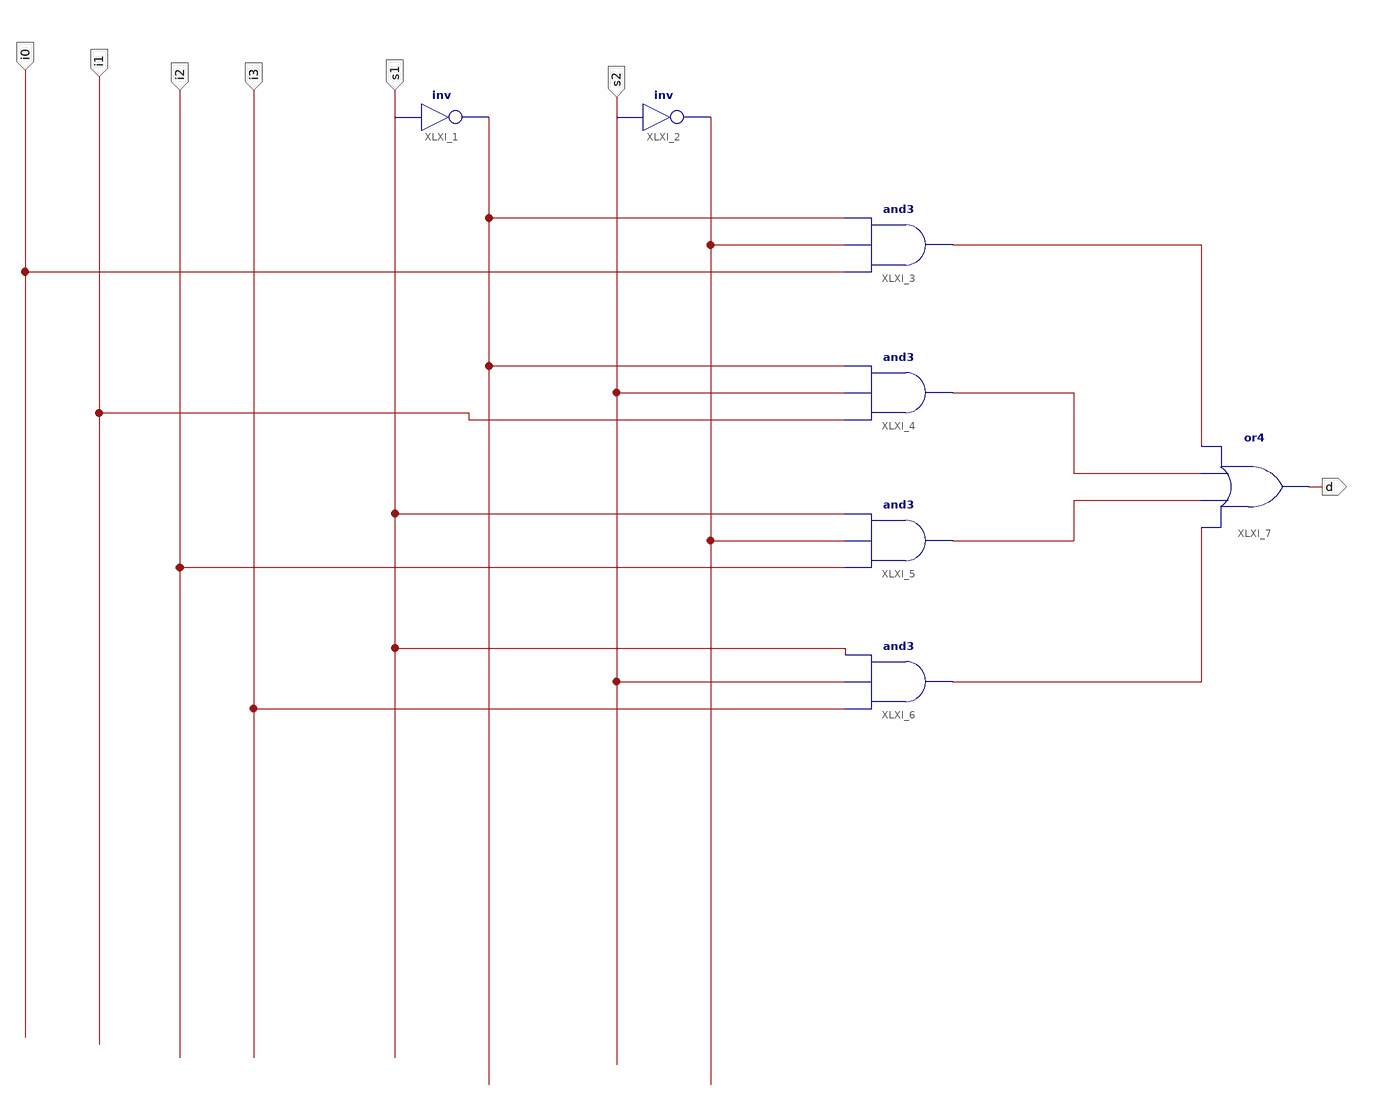
[diagram p0: schematic sheet 1]
// Xilinx ISE schematic Part2A.sch (spartan3e) as structural Verilog: 7 symbols, 7 ports
module Part2A (
  input  i0,
  input  i1,
  input  i2,
  input  i3,
  input  s2,
  input  s1,
  output d
);

  wire XLXN_7, XLXN_8, XLXN_12, XLXN_13, XLXN_14, XLXN_15;

  not XLXI_1 (XLXN_7, s1);
  not XLXI_2 (XLXN_8, s2);
  and XLXI_3 (XLXN_12, i0, XLXN_8, XLXN_7);
  and XLXI_4 (XLXN_13, i1, s2, XLXN_7);
  and XLXI_5 (XLXN_14, i2, XLXN_8, s1);
  and XLXI_6 (XLXN_15, i3, s2, s1);
  or XLXI_7 (d, XLXN_15, XLXN_14, XLXN_13, XLXN_12);
endmodule
